# EAGLE design Desklamp_H201005_V1 (EAGLE 6.4)
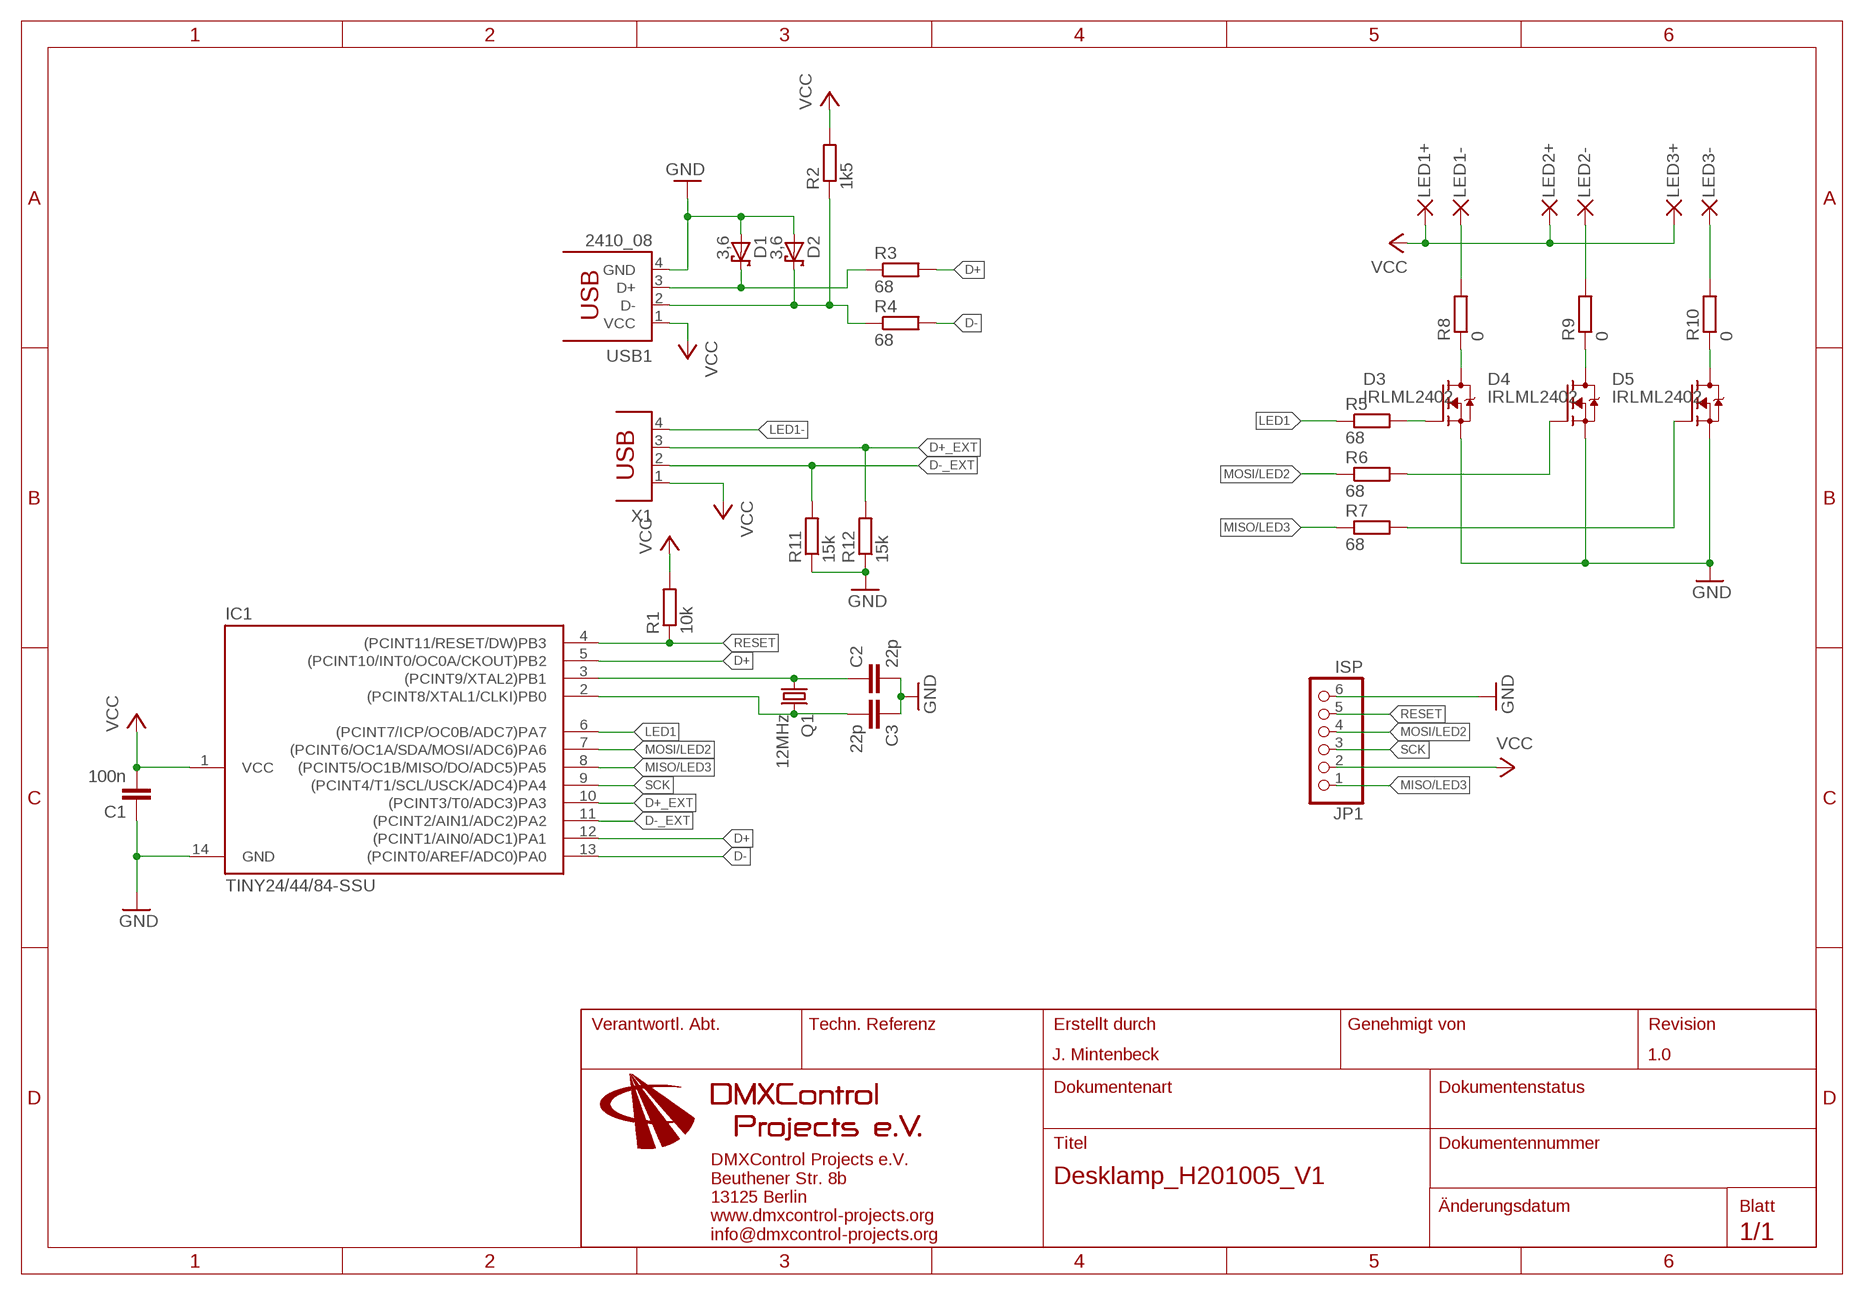
[diagram p0: schematic, sheet 1]

## Parts
C1  100n  C-EUC0805  [C0805]
C2  22p  C-EUC0805  [C0805]
C3  22p  C-EUC0805  [C0805]
D1  3,6  BAS40  [SOT23]
D2  3,6  BAS40  [SOT23]
D3  IRLML2402  [SOT23]
D4  IRLML2402  [SOT23]
D5  IRLML2402  [SOT23]
IC1  TINY24/44/84-SSU  [SOIC14]
JP1  ISP  PINHD-1X06_2.00  [1X06M]
PAD1  LED1+  SMD2  [SMD1,27-2,54]
PAD2  LED1-  SMD2  [SMD1,27-2,54]
PAD3  LED2+  SMD2  [SMD1,27-2,54]
PAD4  LED2-  SMD2  [SMD1,27-2,54]
PAD5  LED3+  SMD2  [SMD1,27-2,54]
PAD6  LED3-  SMD2  [SMD1,27-2,54]
Q1  12MHz  CRYSTALHC49UP  [HC49UP]
R1  10k  R-EU_R0805  [R0805]
R2  1k5  R-EU_R0805  [R0805]
R3  68  R-EU_R0805  [R0805]
R4  68  R-EU_R0805  [R0805]
R5  68  R-EU_R0805  [R0805]
R6  68  R-EU_R0805  [R0805]
R7  68  R-EU_R0805  [R0805]
R8  0  R-EU_R0805  [R0805]
R9  0  R-EU_R0805  [R0805]
R10  0  R-EU_R0805  [R0805]
R11  15k  R-EU_R0805  [R0805]
R12  15k  R-EU_R0805  [R0805]
USB1  2410_08  [2410_08]
X1  PN87520  [PN87520]

## Nets
D+: IC1.5((PCINT10/INT0/OC0A/CKOUT)PB2) IC1.12((PCINT1/AIN0/ADC1)PA1) R3.2
D+_EXT: IC1.10((PCINT3/T0/ADC3)PA3) R12.2 X1.3
D-: IC1.13((PCINT0/AREF/ADC0)PA0) R4.2
D-_EXT: IC1.11((PCINT2/AIN1/ADC2)PA2) R11.2 X1.2
GND: C1.1 C2.2 C3.1 D1.1(A) D2.1(A) D3.2(S) D4.2(S) D5.2(S) IC1.14(GND) JP1.6 R11.1 R12.1 USB1.4(GND)
LED1: IC1.6((PCINT7/ICP/OC0B/ADC7)PA7) R5.1
LED1-: PAD2.1(P) R8.2 X1.4
LED2-: PAD4.1(P) R9.2
LED3-: PAD6.1(P) R10.2
MISO/LED3: IC1.8((PCINT5/OC1B/MISO/DO/ADC5)PA5) JP1.1 R7.1
MOSI/LED2: IC1.7((PCINT6/OC1A/SDA/MOSI/ADC6)PA6) JP1.4 R6.1
N$1: D3.3(D) R8.1
N$2: D4.3(D) R9.1
N$3: D4.1(G) R6.2
N$4: D5.3(D) R10.1
N$6: D1.3(C) R3.1 USB1.3(D+)
N$7: D2.3(C) R2.1 R4.1 USB1.2(D-)
N$8: C3.2 IC1.2((PCINT8/XTAL1/CLKI)PB0) Q1.2
N$10: C2.1 IC1.3((PCINT9/XTAL2)PB1) Q1.1
N$11: D3.1(G) R5.2
N$12: D5.1(G) R7.2
RESET: IC1.4((PCINT11/RESET/DW)PB3) JP1.5 R1.1
SCK: IC1.9((PCINT4/T1/SCL/USCK/ADC4)PA4) JP1.3
VCC: C1.2 IC1.1(VCC) JP1.2 PAD1.1(P) PAD3.1(P) PAD5.1(P) R1.2 R2.2 USB1.1(VCC) X1.1

## Notes on the sheet
- J. Mintenbeck | 1.0

## Library data of the parts
C1 = rcl:C-EU: CAPACITOR, European symbol; PARTNO: CC0805KRX7R9BB104
C2 C3 = rcl:C-EU: CAPACITOR, European symbol; PARTNO: VVS-SMD COG 50 V 22 PF G0805
D1 D2 = diode:BAS40: Silicon Schottky Diodes General-purpose diode for high-speed switching; PARTNO: BZX84C3V6
D3-D5 = transistor-fet:IRLML2402; PARTNO: IRLML2402PBF
IC1 = avr-7:TINY24/44/84; PARTNO: ATTINY44ASSU
JP1 = pinhead-2:PINHD-1X06: PIN HEADER
PAD1-PAD6 = wirepad:SMD2: SMD PAD
Q1 = crystal:CRYSTAL: CRYSTAL; OC_FARNELL: unknown; OC_NEWARK: unknown; PARTNO: 12.000MHZ 49USMX/30/50/40/18PF/ATF
R1 = rcl:R-EU_: RESISTOR, European symbol; PARTNO: RC0805 FR-07 10 K
R2 = rcl:R-EU_: RESISTOR, European symbol; PARTNO: RC0805 FR-07 1,5 K
R3-R7 = rcl:R-EU_: RESISTOR, European symbol; PARTNO: RC0805 FR-07 68 R
R8-R10 = rcl:R-EU_: RESISTOR, European symbol; PARTNO: RC0805 FR-07 0 R
R11 R12 = rcl:R-EU_: RESISTOR, European symbol; PARTNO: RC0805 FR-07 15 K
USB1 = con-lumberg:2410_08; PARTNO: 2410 08
X1 = con-berg:PN87520: BERG USB connector; OC_FARNELL: unknown; OC_NEWARK: unknown

## Board
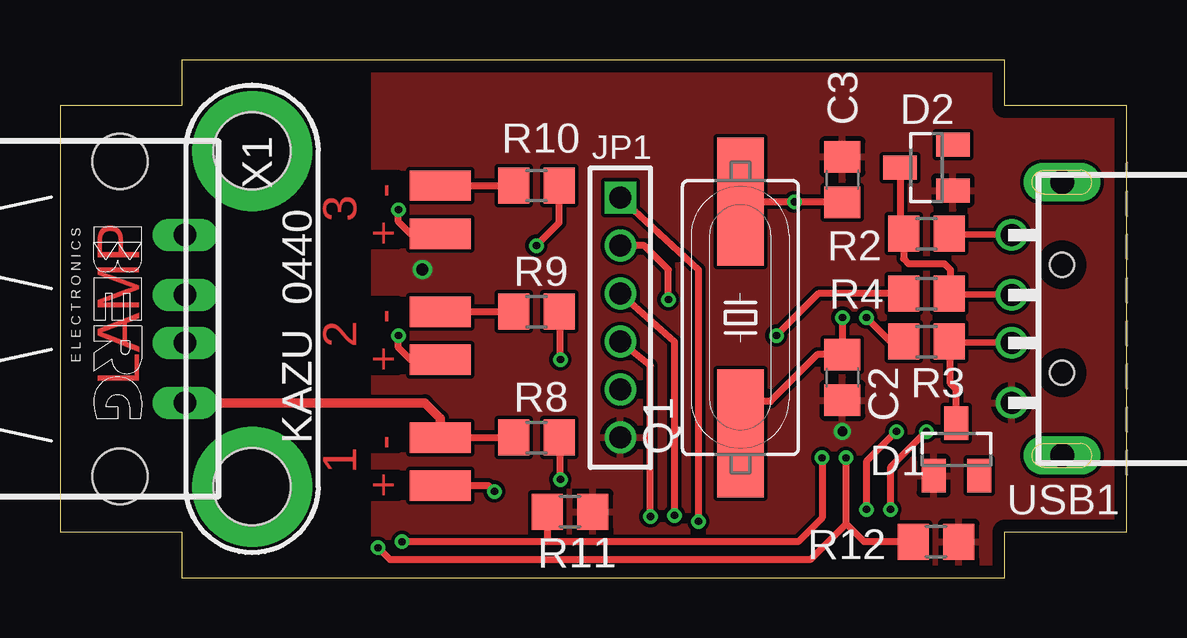
[diagram p1: board, top side]
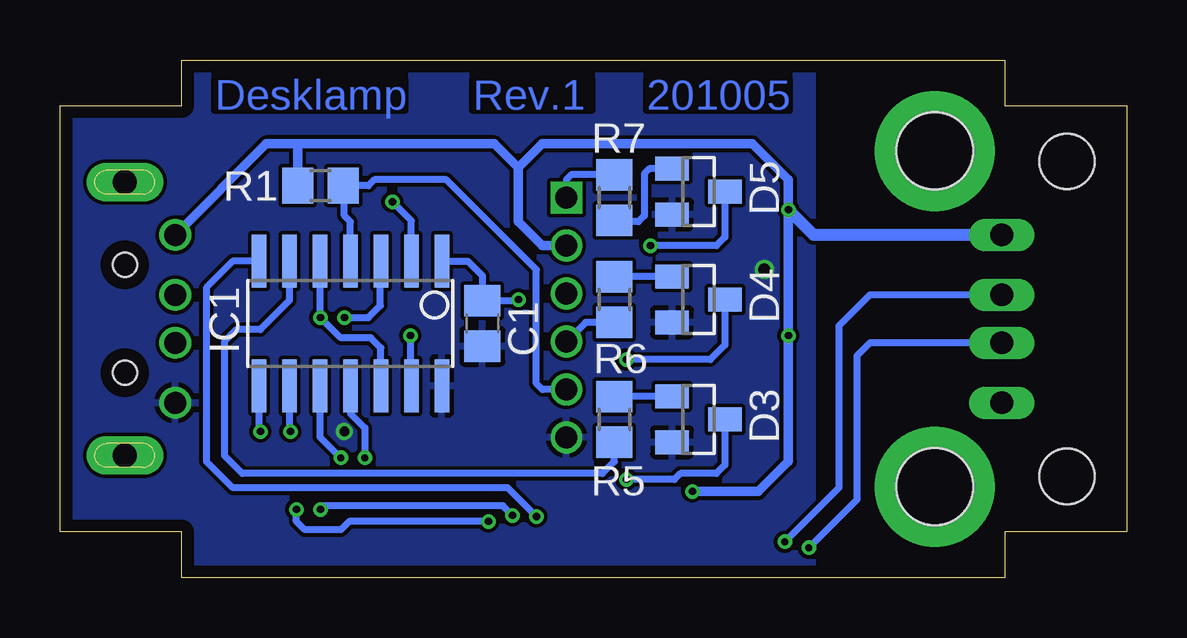
[diagram p2: board, bottom side, seen from below]

Size 44.45 x 21.59 mm. Coordinates in mm from the lower left corner, seen from the top.
Outline: 0,1.91 5.08,1.91 5.08,0 39.37,0 39.37,1.91 44.45,1.91 44.45,19.68 39.37,19.68 39.37,21.59 5.08,21.59 5.08,19.68 0,19.68 0,1.91
Copper layers (1*16): Top 0.035mm / dielectric 1.5mm / Bottom 0.035mm
Design rules "leiton": minimum track width 6mil, minimum drill 0.3mm, track to track 6mil, track to pad 6mil, pad to pad 6mil, via to via 6mil, smd to smd 6mil, copper to edge 20mil, drill to drill 8mil, minimum pad ring 8mil, minimum via ring 6mil, stop-mask expansion 3mil, vias tented up to drill 0mil, thermal gap 8mil

### Footprints (pad centres in the part's own frame; a part is rotated, then mirrored left to right if it is on the bottom)
C0805 = smd 1.3 x 1.5: 1 -0.95,0; 2 0.95,0
SOT23 = smd 1 x 1.4: 1 -0.95,-1.1; 2 0.95,-1.1; 3 0,1.1
SOIC14 = smd 0.61 x 2.21: 1 -3.81,-2.603; 2 -2.54,-2.603; 3 -1.27,-2.603; 4 0,-2.603; 5 1.27,-2.603; 6 2.54,-2.603; 7 3.81,-2.603; 8 3.81,2.603; 9 2.54,2.603; 10 1.27,2.603; 11 0,2.603; 12 -1.27,2.603; 13 -2.54,2.603; 14 -3.81,2.603
1X06M = drill 0.914 square: 1 -5,0 | drill 0.914: 2 -3,0; 3 -1,0; 4 1,0; 5 3,0; 6 5,0
SMD1,27-2,54 = smd 1.27 x 2.54: 1 0,0
HC49UP = smd 5.334 x 1.93: 1 -4.826,0; 2 4.826,0
R0805 = smd 1.3 x 1.5: 1 -0.95,0; 2 0.95,0
KAZU_0440 = drill 3.2 pad 5: P$1 -7,0; P$2 7,0 | hole 3.2: -7,0; 7,0
2410_08 = drill 0.92: 1 3.5,2.1; 2 1,2.1; 3 -1,2.1; 4 -3.5,2.1 | drill 1 pad 1.6 long: P$1 -5.7,0; P$2 5.7,0 | hole 1: -2.25,0; 2.25,0
PN87520 = drill 0.95 long: 1 -3.5,2.71; 2 -1,2.71; 3 1,2.71; 4 3.5,2.71 | hole 2.3: -6.57,0; 6.57,0

### Placement (x,y rotation side)
C1  26.85,10.6 90 bottom
C2  32.6,8.35 270 top
C3  32.6,16.6 270 top
D1  37.35,5.35 0 top
D2  36.1,17.1 90 top
D3  17.85,6.6 270 bottom
D4  17.85,11.6 270 bottom
D5  17.85,16.1 270 bottom
IC1  32.35,10.6 180 bottom
JP1  23.35,10.85 270 top
PAD1  15.85,3.85 90 top
PAD2  15.85,5.85 270 top
PAD3  15.85,9.1 90 top
PAD4  15.85,11.1 270 top
PAD5  15.85,14.35 90 top
PAD6  15.85,16.35 270 top
Q1  28.35,10.85 90 top
R1  33.6,16.35 180 bottom
R2  36.1,14.35 0 top
R3  36.1,9.85 180 top
R4  36.1,11.85 180 top
R5  21.35,6.6 90 bottom
R6  21.35,11.6 90 bottom
R7  21.35,15.85 270 bottom
R8  19.85,5.85 180 top
R9  19.85,11.1 180 top
R10  19.85,16.35 180 top
R11  21.25,2.75 180 top
R12  36.5,1.5 180 top
U$1  KAZU_0440  [KAZU_0440]  8,10.79 90 top
USB1  41.75,10.79 90 top
X1  2.5,10.79 270 top

### Tracks (layer width: path | path; a pad name or v marks a point on that pad's centre or on a via)
D+  (via drill 0.3)
  Top 0.3: R3.2 34.6,9.85 v33.6,10.85
  Bottom 0.3: IC1.5 33.6,13.18 v33.6,10.85 32.75,10 31.5,10 31.08,9.58 IC1.12
D+_EXT  (via drill 0.3)
  Top 0.3: v13.25,1.25 13.75,0.75 31.25,0.75 32.75,2.25 | R12.2 33.5,1.5 32.75,2.25 | 32.75,2.25 v32.75,5
  Bottom 0.3: IC1.10 33.62,5.87 v32.75,5 | X1.3 10.71,9.79 11.25,9.25 11.25,3.25 v13.25,1.25
D-  (via drill 0.3)
  Top 0.3: R4.2 31.6,11.85 v29.85,10.1
  Bottom 0.3: v29.85,10.1 29.85,8.04 IC1.13
D-_EXT  (via drill 0.3)
  Top 0.3: v31.75,5 31.75,2.5 30.75,1.5 20.25,1.5 | 20.25,1.5 v14.25,1.5 | R11.2 20.3,1.55 20.25,1.5
  Bottom 0.3: IC1.11 32.35,6.85 31.75,6.25 v31.75,5 | X1.2 10.71,11.79 12,10.5 12,3.75 v14.25,1.5
GND  (via drill 0.4, 0.5)
  other vias: 32.6,6.1 15.1,12.85
  pour Bottom: 13.1,21.59 13.1,0 44.6,0 44.6,21.59
  pour Top: 13.1,21.59 13.1,0 44.6,0 44.6,21.59
LED1
  Bottom 0.3: IC1.6 34.89,11.56 36.1,10.35 37.1,10.35 37.6,9.85 37.6,5.1 36.85,4.35 21.85,4.35 21.35,4.85 R5.1
LED1-
  Top 0.3: PAD2.1 R8.2
  Top 0.4: X1.4 15.21,7.29 15.85,6.65 PAD2.1
LED2-
  Top 0.3: PAD4.1 R9.2
LED3-
  Top 0.3: PAD6.1 R10.2
MISO/LED3  (via drill 0.3)
  Top 0.3: JP1.1 26.6,12.85 v26.6,2.35 | v36.1,6.1 34.6,4.6 v34.6,2.85
  Bottom 0.3: R7.1 23.15,16.8 23.35,16.6 JP1.1 | IC1.8 36.16,6.16 v36.1,6.1 | v26.6,2.35 32.4,2.35 32.75,2 34.25,2 34.6,2.35 v34.6,2.85
MOSI/LED2  (via drill 0.3)
  Top 0.3: v24.6,2.55 24.6,8.85 JP1.4
  Bottom 0.3: R6.1 22.55,10.65 JP1.4 | IC1.7 37.25,13.2 38.35,12.1 38.35,4.85 37.25,3.75 25.8,3.75 v24.6,2.55
N$1  (via drill 0.3)
  Top 0.3: v20.85,4.1 20.85,5.8 R8.1
  Bottom 0.3: D3.3 16.75,4.7 17.1,4.35 18.6,4.35 18.85,4.1 v20.85,4.1
N$2  (via drill 0.3)
  Top 0.3: v20.85,9.1 20.85,11.05 R9.1
  Bottom 0.3: D4.3 16.75,9.7 17.35,9.1 v20.85,9.1
N$3
  Bottom 0.3: D4.1 R6.2
N$4  (via drill 0.3)
  Top 0.3: v19.85,13.85 20.8,14.8 R10.1
  Bottom 0.3: D5.3 16.75,14.2 17.1,13.85 v19.85,13.85
N$6
  Top 0.3: USB1.3 37.09,9.8 R3.1 37.1,9.8 37.1,8.1 37.35,7.85 D1.3
N$7
  Top 0.3: USB1.2 37.09,11.8 R4.1 37.1,11.9 37.1,12.85 36.85,13.1 35.35,13.1 35.15,13.3 R2.1 35,14.75 D2.3
N$8  (via drill 0.3)
  Top 0.3: Q1.2 v30.6,15.68 32.57,15.68 C3.2
  Bottom 0.3: IC1.2 29.81,14.89 v30.6,15.68
N$10  (via drill 0.3)
  Top 0.3: 28.35,7.6 28.35,7.35 | 28.35,7.35 Q1.1 | v32.6,10.85 C2.1 31.55,9.3 29.6,7.35 28.35,7.35
  Bottom 0.3: v32.6,10.85 31.6,10.85 31.1,11.35 31.1,13.18 IC1.3
N$11
  Bottom 0.3: D3.1 R5.2
N$12
  Bottom 0.3: D5.1 19.9,17.05 20.1,16.85 20.1,15.1 20.35,14.85 21.3,14.85 R7.2
RESET
  Bottom 0.3: IC1.4 32.35,14.85 32.6,15.1 32.6,16.3 R1.1 31.6,16.35 31.35,16.6 28.35,16.6 24.6,12.85 24.6,8.1 24.35,7.85 JP1.5
SCK  (via drill 0.3)
  Top 0.3: JP1.3 25.6,9.85 v25.6,2.6 | v34.85,6.1 33.6,4.85 v33.6,2.85
  Bottom 0.3: IC1.9 34.89,6.14 v34.85,6.1 | v25.6,2.6 26,3 33.45,3 v33.6,2.85
VCC  (via drill 0.3)
  Top 0.3: USB1.1 37.09,14.3 R2.2 | PAD1.1 17.85,3.85 v18.1,3.6 | PAD3.1 14.6,9.1 14.1,9.6 v14.1,10.1 | PAD5.1 14.6,14.35 14.1,14.85 v14.1,15.35 | v25.35,11.6 25.35,12.85 24.35,13.85 JP1.2
  Bottom 0.3: 34.55,18.05 34.6,18.1 | IC1.1 27.45,13.2 26.85,12.6 C1.2 25.4,11.55 v25.35,11.6
  Bottom 0.4: v18.1,3.6 15.35,3.6 14.1,4.85 v14.1,10.1 v14.1,15.35 14.1,16.6 15.6,18.1 24.35,18.1 25.35,17.1 | JP1.2 24.35,13.85 25.35,14.85 25.35,17.1 | 25.35,17.1 26.35,18.1 34.6,18.1 35.85,18.1 USB1.1 | R1.2 34.55,18.05
  Bottom 0.5: X1.1 13.04,14.29 v14.1,15.35

### Text on the board
Top: - | 3 | + | - | 2 | + | LAMP | - | 1 | +
Bottom: 201005 | Rev.1 | Desklamp